# EAGLE schematic MAPLE-CUN-V023 (EAGLE 7.3.0)
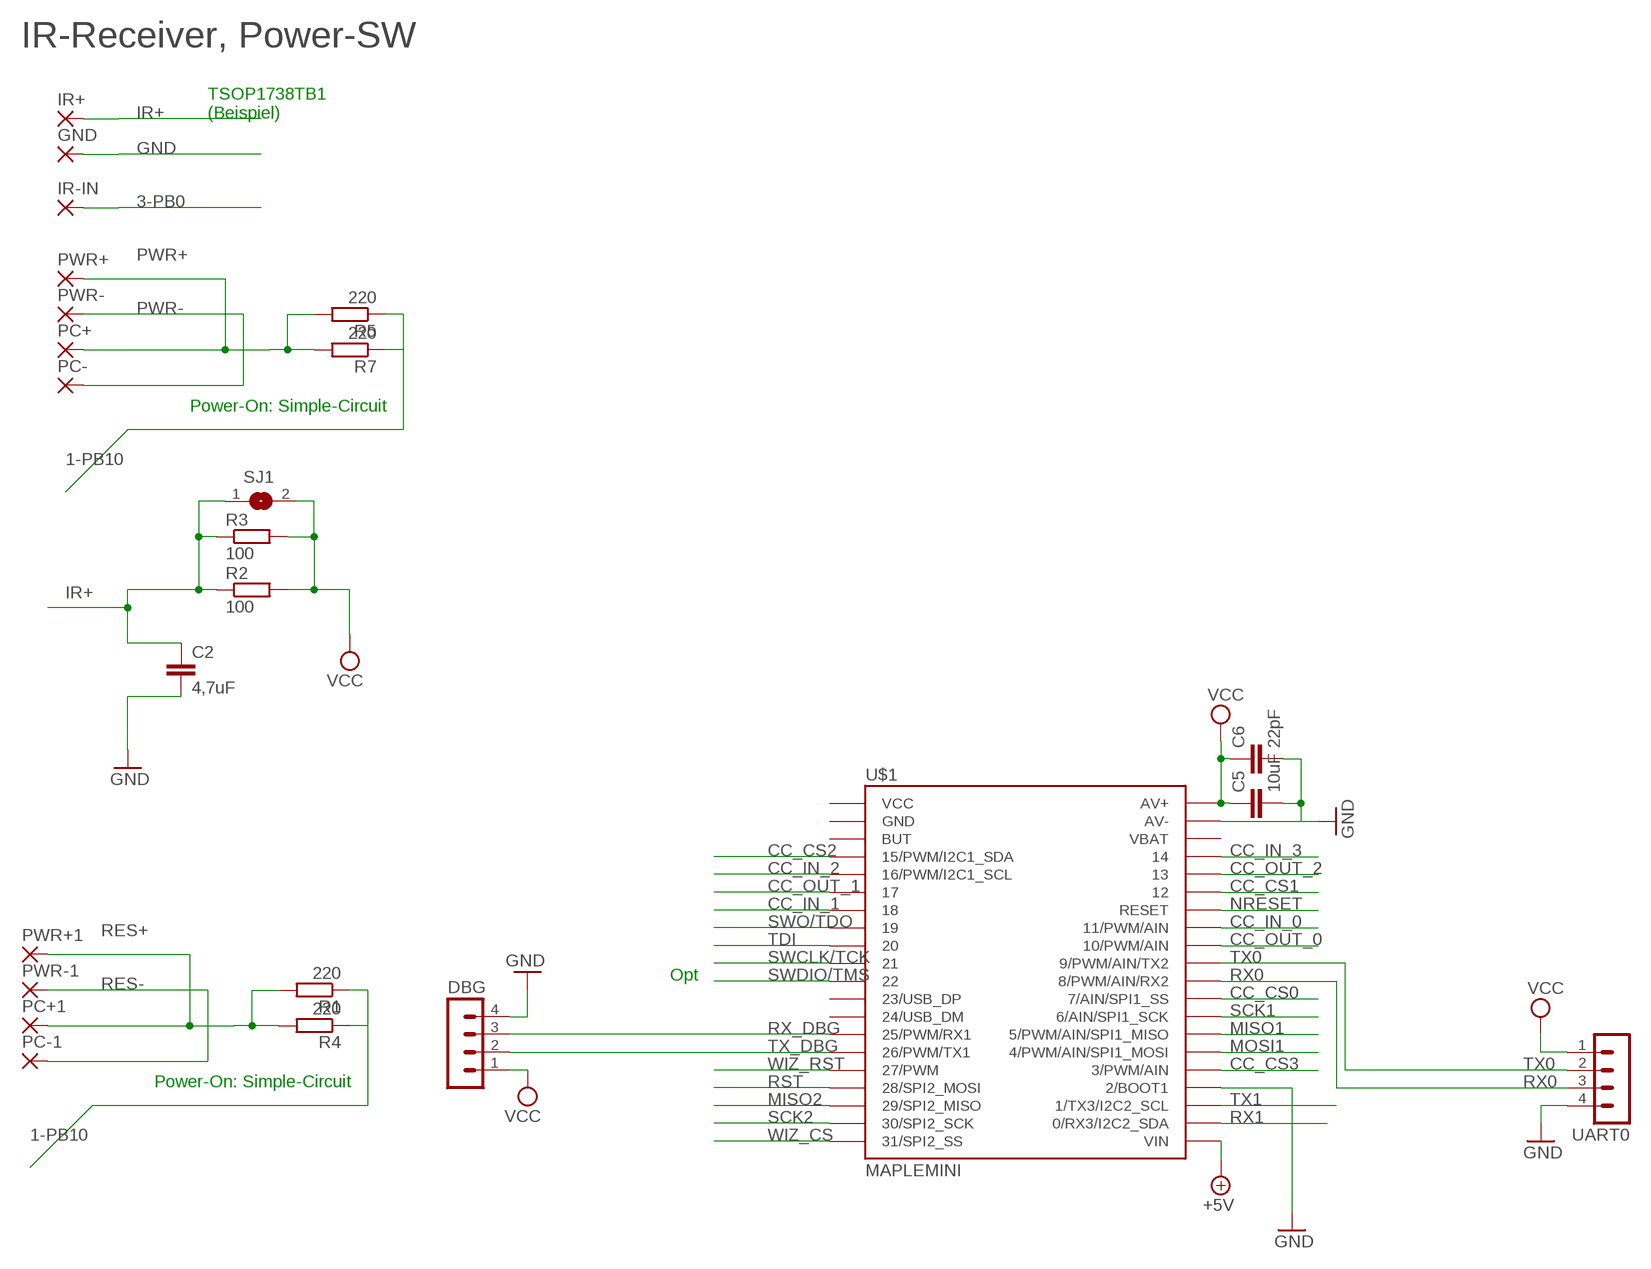
[diagram p0: schematic, sheet 1]

## Parts
C2  4,7uF  C-EUC1206K  [C1206K]
C5  10uF  C-EUC1210  [C1210]
C6  22pF  C-EUC0805  [C0805]
DBG  MA04-1  [MA04-1]
GND  SMD2  [SMD1,27-2,54]
IR+  SMD2  [SMD1,27-2,54]
IR-IN  SMD2  [SMD1,27-2,54]
PC+  SMD2  [SMD1,27-2,54]
PC+1  SMD2  [SMD1,27-2,54]
PC-  SMD2  [SMD1,27-2,54]
PC-1  SMD2  [SMD1,27-2,54]
PWR+  SMD2  [SMD1,27-2,54]
PWR+1  SMD2  [SMD1,27-2,54]
PWR-  SMD2  [SMD1,27-2,54]
PWR-1  SMD2  [SMD1,27-2,54]
R1  220  R-EU_0204/7  [0204/7]
R2  100  R-EU_0204/7  [0204/7]
R3  100  R-EU_R0805W  [R0805W]
R4  220  R-EU_R0805W  [R0805W]
R5  220  R-EU_0204/7  [0204/7]
R7  220  R-EU_R0805W  [R0805W]
SJ1  SJ  [SJ]
U$1  MAPLEMINI  [20-DIP]
UART0  MA04-1  [MA04-1]

## Nets
1-PB10: R1.1 R4.1 R5.1 R7.1
3-PB0: IR-IN.1(P)
+5V: U$1.21(VIN)
CC_CS0: U$1.29(7/AIN/SPI1_SS)
CC_CS1: U$1.35
CC_CS2: U$1.4(15/PWM/I2C1_SDA)
CC_CS3: U$1.25(3/PWM/AIN)
CC_IN_0: U$1.33(11/PWM/AIN)
CC_IN_1: U$1.7
CC_IN_2: U$1.5(16/PWM/I2C1_SCL)
CC_IN_3: U$1.37
CC_OUT_0: U$1.32(10/PWM/AIN)
CC_OUT_1: U$1.6
CC_OUT_2: U$1.36
GND: C2.2 C5.2 C6.2 DBG.4 GND.1(P) U$1.24(2/BOOT1) U$1.39(AV-) UART0.4
IR+: C2.1 IR+.1(P) R2.1 R3.1 SJ1.1
MISO1: U$1.27(5/PWM/AIN/SPI1_MISO)
MISO2: U$1.18(29/SPI2_MISO)
MOSI1: U$1.26(4/PWM/AIN/SPI1_MOSI)
NRESET: U$1.34(RESET)
PWR+: PC+.1(P) PWR+.1(P) R5.2 R7.2
PWR-: PC-.1(P) PWR-.1(P)
RES+: PC+1.1(P) PWR+1.1(P) R1.2 R4.2
RES-: PC-1.1(P) PWR-1.1(P)
RST: U$1.17(28/SPI2_MOSI)
RX0: U$1.30(8/PWM/AIN/RX2) UART0.3
RX1: U$1.22(0/RX3/I2C2_SDA)
RX_DBG: DBG.3 U$1.14(25/PWM/RX1)
SCK1: U$1.28(6/AIN/SPI1_SCK)
SCK2: U$1.19(30/SPI2_SCK)
SWCLK/TCK: U$1.10
SWDIO/TMS: U$1.11
SWO/TDO: U$1.8
TDI: U$1.9
TX0: U$1.31(9/PWM/AIN/TX2) UART0.2
TX1: U$1.23(1/TX3/I2C2_SCL)
TX_DBG: DBG.2 U$1.15(26/PWM/TX1)
VCC: C5.1 C6.1 DBG.1 R2.2 R3.2 SJ1.2 U$1.40(AV+) UART0.1
WIZ_CS: U$1.20(31/SPI2_SS)
WIZ_RST: U$1.16(27/PWM)
Unconnected: U$1.1(VCC) U$1.2(GND) U$1.3(BUT) U$1.12(23/USB_DP) U$1.13(24/USB_DM) U$1.38(VBAT)

## Notes on the sheet
- IR-Receiver, Power-SW
- TSOP1738TB1
  (Beispiel)
- Power-On: Simple-Circuit
- Opt
- Power-On: Simple-Circuit

## Library data of the parts
C2 C5 C6 = rcl:C-EU: CAPACITOR, European symbol
DBG UART0 = con-lstb:MA04-1: PIN HEADER; OC_FARNELL: unknown; OC_NEWARK: unknown
GND IR+ IR-IN PC+ PC+1 PC- PC-1 PWR+ PWR+1 PWR- PWR-1 = wirepad:SMD2: SMD PAD
R1-R5 R7 = rcl:R-EU_: RESISTOR, European symbol
SJ1 = jumper:SJ: SMD solder JUMPER
U$1 = maplemini-small:MAPLEMINI

## Net classes
0 default: width 0.406 mm
1 PWR: width 0.305 mm